# EAGLE design macropad (EAGLE 9.6.2)
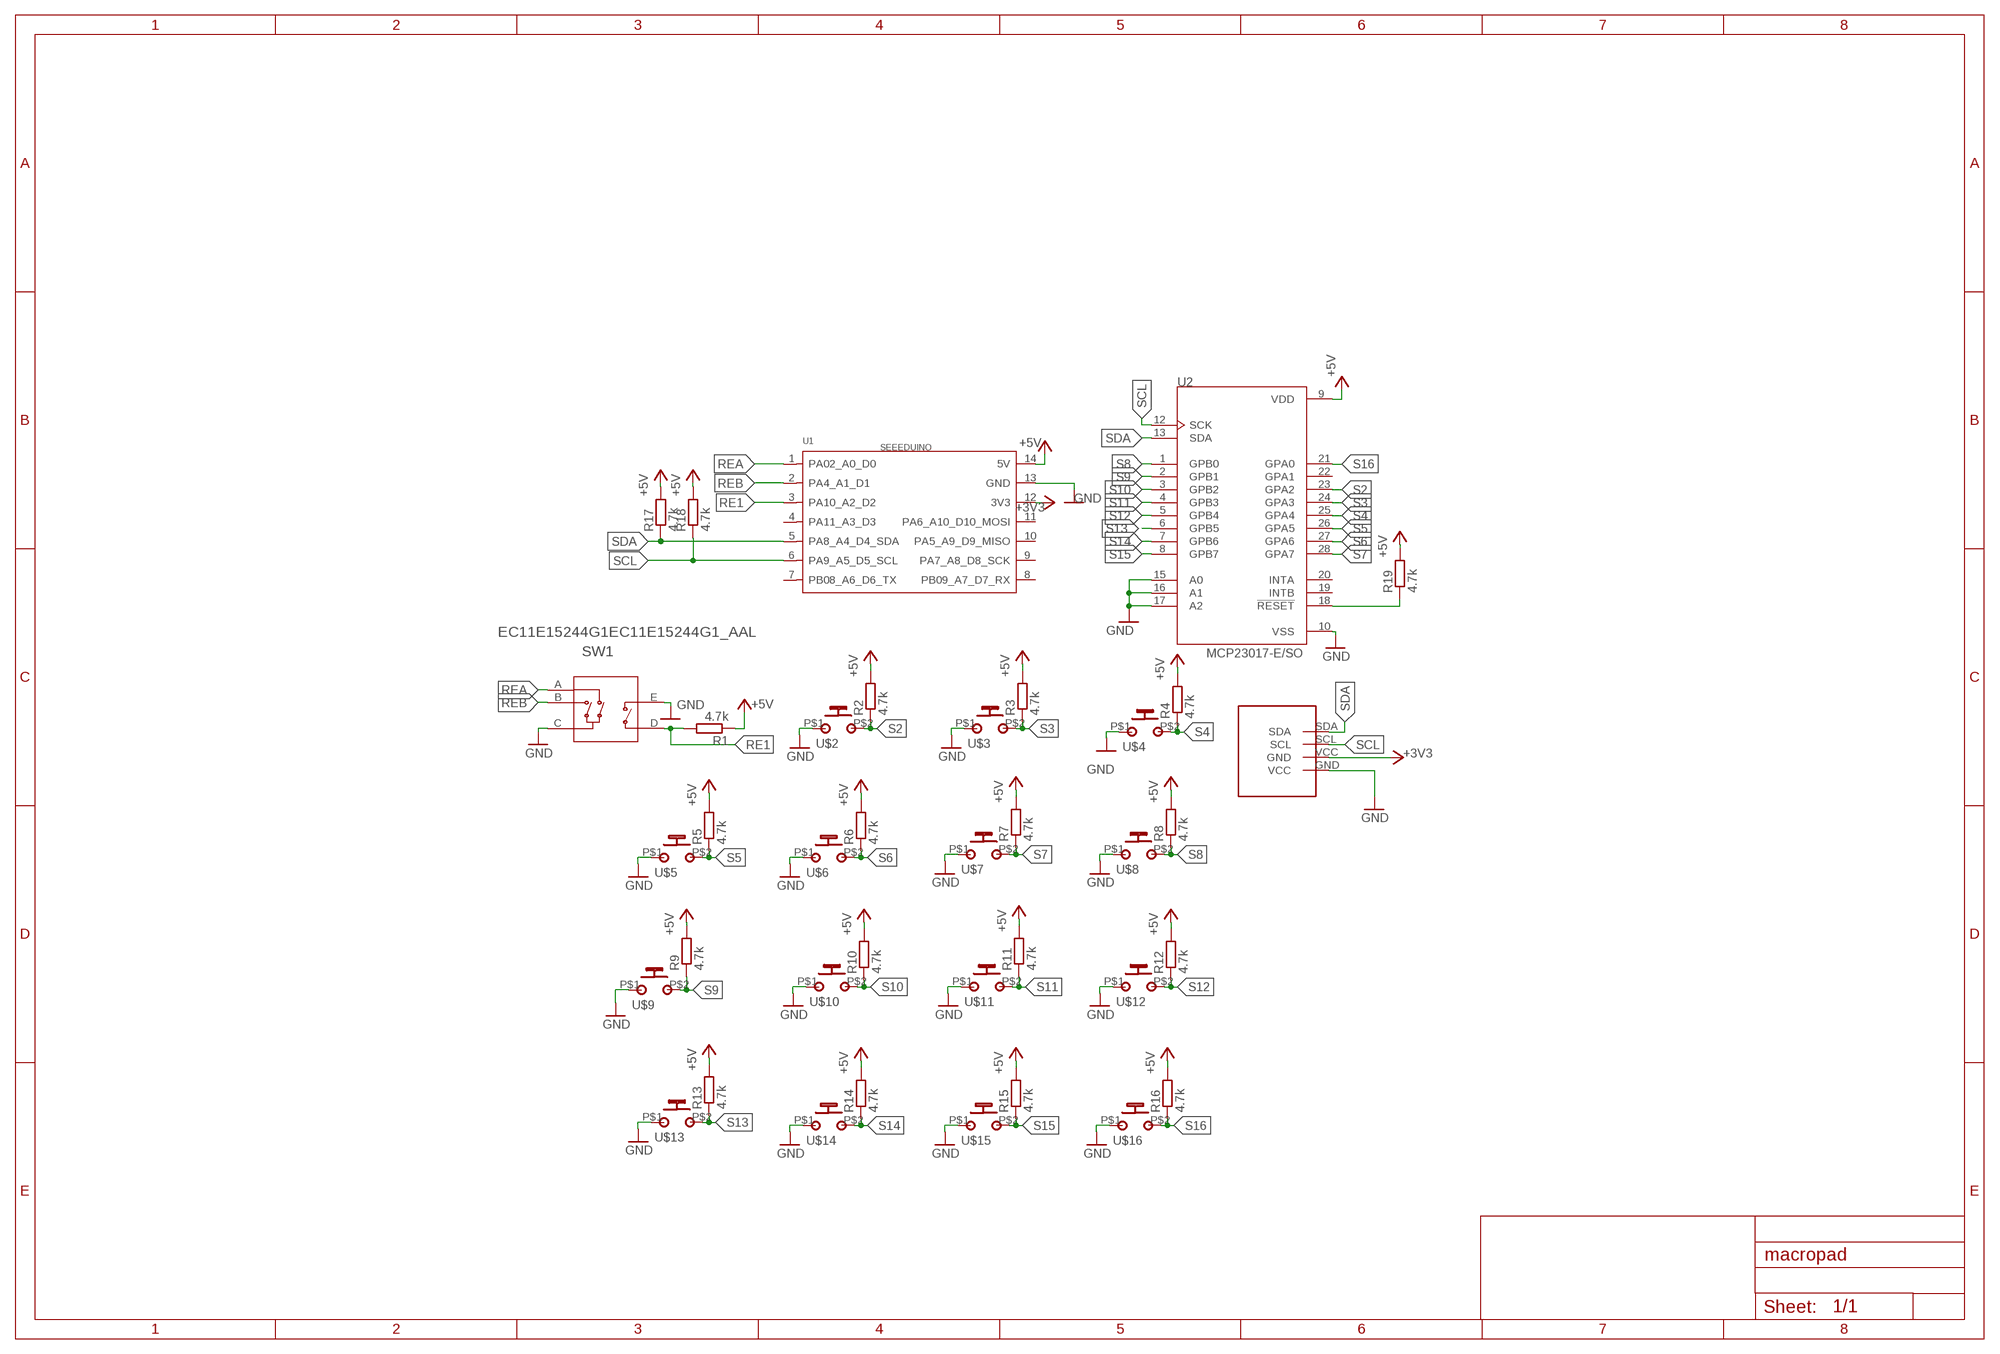
[diagram p0: schematic, sheet 1]

## Parts
DISPLAY  OLED_0.96_I2C  [OLED_0.96_I2C]
R1  4.7k  R-EU_R0805  [R0805]
R2  4.7k  R-EU_R0805  [R0805]
R3  4.7k  R-EU_R0805  [R0805]
R4  4.7k  R-EU_R0805  [R0805]
R5  4.7k  R-EU_R0805  [R0805]
R6  4.7k  R-EU_R0805  [R0805]
R7  4.7k  R-EU_R0805  [R0805]
R8  4.7k  R-EU_R0805  [R0805]
R9  4.7k  R-EU_R0805  [R0805]
R10  4.7k  R-EU_R0805  [R0805]
R11  4.7k  R-EU_R0805  [R0805]
R12  4.7k  R-EU_R0805  [R0805]
R13  4.7k  R-EU_R0805  [R0805]
R14  4.7k  R-EU_R0805  [R0805]
R15  4.7k  R-EU_R0805  [R0805]
R16  4.7k  R-EU_R0805  [R0805]
R17  4.7k  R-EU_R0805  [R0805]
R18  4.7k  R-EU_R0805  [R0805]
R19  4.7k  R-EU_R0805  [R0805]
SW1  EC11E15244G1EC11E15244G1_AAL  [EC11E15244G1_AAL]
U1  SEEEDUINO  MOUDLE-SEEEDUINO-XIAO  [MOUDLE14P-2.54-21X17.8MM]
U2  MCP23017-E/SO  [SOIC127P1030X265-28N]
U$2  MX1A-11NN  [CHERRY_MX1A-11NN_SWITCH]
U$3  MX1A-11NN  [CHERRY_MX1A-11NN_SWITCH]
U$4  MX1A-11NN  [CHERRY_MX1A-11NN_SWITCH]
U$5  MX1A-11NN  [CHERRY_MX1A-11NN_SWITCH]
U$6  MX1A-11NN  [CHERRY_MX1A-11NN_SWITCH]
U$7  MX1A-11NN  [CHERRY_MX1A-11NN_SWITCH]
U$8  MX1A-11NN  [CHERRY_MX1A-11NN_SWITCH]
U$9  MX1A-11NN  [CHERRY_MX1A-11NN_SWITCH]
U$10  MX1A-11NN  [CHERRY_MX1A-11NN_SWITCH]
U$11  MX1A-11NN  [CHERRY_MX1A-11NN_SWITCH]
U$12  MX1A-11NN  [CHERRY_MX1A-11NN_SWITCH]
U$13  MX1A-11NN  [CHERRY_MX1A-11NN_SWITCH]
U$14  MX1A-11NN  [CHERRY_MX1A-11NN_SWITCH]
U$15  MX1A-11NN  [CHERRY_MX1A-11NN_SWITCH]
U$16  MX1A-11NN  [CHERRY_MX1A-11NN_SWITCH]

## Nets
+3V3: DISPLAY.VCC(GND) U1.12(3V3)
+5V: R1.1 R2.2 R3.2 R4.2 R5.2 R6.2 R7.2 R8.2 R9.2 R10.2 R11.2 R12.2 R13.2 R14.2 R15.2 R16.2 R17.2 R18.2 R19.2 U1.14(5V) U2.9(VDD)
GND: DISPLAY.GND(VCC) SW1.C SW1.E U1.13(GND) U2.10(VSS) U2.15(A0) U2.16(A1) U2.17(A2) U$2.P$1(P) U$3.P$1(P) U$4.P$1(P) U$5.P$1(P) U$6.P$1(P) U$7.P$1(P) U$8.P$1(P) U$9.P$1(P) U$10.P$1(P) U$11.P$1(P) U$12.P$1(P) U$13.P$1(P) U$14.P$1(P) U$15.P$1(P) U$16.P$1(P)
N$1: R19.1 U2.18(!RESET)
RE1: R1.2 SW1.D U1.3(PA10_A2_D2)
REA: SW1.A U1.1(PA02_A0_D0)
REB: SW1.B U1.2(PA4_A1_D1)
S2: R2.1 U2.23(GPA2) U$2.P$2(S)
S3: R3.1 U2.24(GPA3) U$3.P$2(S)
S4: R4.1 U2.25(GPA4) U$4.P$2(S)
S5: R5.1 U2.26(GPA5) U$5.P$2(S)
S6: R6.1 U2.27(GPA6) U$6.P$2(S)
S7: R7.1 U2.28(GPA7) U$7.P$2(S)
S8: R8.1 U2.1(GPB0) U$8.P$2(S)
S9: R9.1 U2.2(GPB1) U$9.P$2(S)
S10: R10.1 U2.3(GPB2) U$10.P$2(S)
S11: R11.1 U2.4(GPB3) U$11.P$2(S)
S12: R12.1 U2.5(GPB4) U$12.P$2(S)
S13: R13.1 U2.6(GPB5) U$13.P$2(S)
S14: R14.1 U2.7(GPB6) U$14.P$2(S)
S15: R15.1 U2.8(GPB7) U$15.P$2(S)
S16: R16.1 U2.21(GPA0) U$16.P$2(S)
SCL: DISPLAY.SCL R18.1 U1.6(PA9_A5_D5_SCL) U2.12(SCK)
SDA: DISPLAY.SDA R17.1 U1.5(PA8_A4_D4_SDA) U2.13(SDA)
Unconnected: U1.4(PA11_A3_D3) U1.7(PB08_A6_D6_TX) U1.8(PB09_A7_D7_RX) U1.9(PA7_A8_D8_SCK) U1.10(PA5_A9_D9_MISO) U1.11(PA6_A10_D10_MOSI) U2.19(INTB) U2.20(INTA) U2.22(GPA1)

## Library data of the parts
DISPLAY = tft_1_8_1_44_oled_0_96:OLED_0.96_I2C
R1-R19 = rcl:R-EU_: RESISTOR, European symbol; SPICEPREFIX: R
SW1 = 2023-04-18_22-45-36_Library:EC11E15244G1; COPYRIGHT: Copyright (C) 2023 Ultra Librarian. All rights reserved.; MANUFACTURER_PART_NUMBER: EC11E15244G1; MFR_NAME: Alps Electric; TYPE: Encoders
U1 = Seeeduino XIAO:MOUDLE-SEEEDUINO-XIAO
U2 = MCP23017-E_SO:MCP23017-E/SO: MCP23017 Series 5.5 V 1.7 MHz SMT 16-Bit I2C I/O Expander - SOIC-28 Check availability <https://pricing.snapeda.com/parts/MCP23017-E/SO/Microchip/view-part?ref=eda>; AVAILABILITY: In Stock; DESCRIPTION: I/O Expander 16 I²C 1.7 MHz 28-SOIC; MF: Microchip; MP: MCP23017-E/SO; PACKAGE: SOIC-28 Microchip; PRICE: None; PURCHASE-URL: https://pricing.snapeda.com/search/part/MCP23017-E/SO/?ref=eda
U$2-U$16 = MX1A-11NN:MX1A-11NN: Check availability <https://pricing.snapeda.com/parts/MX1A11NN/Cherry/view-part?ref=eda>; AVAILABILITY: In Stock; DESCRIPTION: SWITCH, TACTILE, SPST-NO, 10mA, THOUGH HOLE; Product Range:MX Series; Actuator Orientation:Top Actuated; Switch Mounting:Surface Mount; Actuator Style:Plunger for Cap; Actuating Force:59.5gf; Contact Rating:10mA at 12VDC RoHS Compliant: No; MF: Cherry; MP: MX1A11NN; PACKAGE: None; PRICE: None; PURCHASE-URL: https://pricing.snapeda.com/search/part/MX1A11NN/?ref=eda

## Board
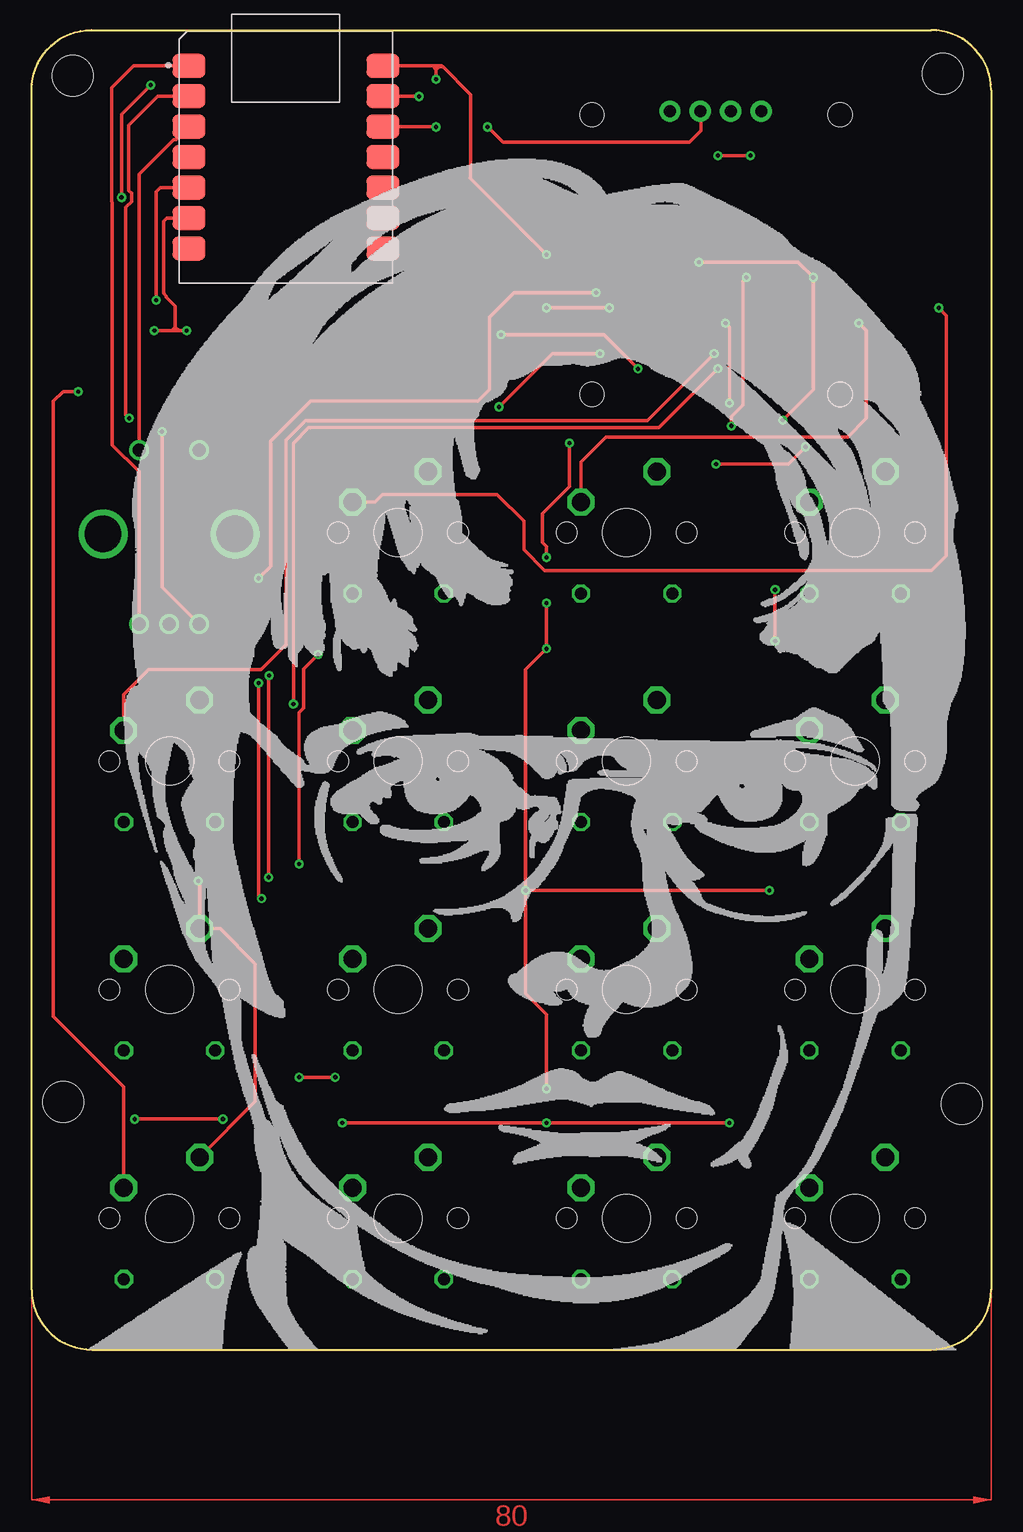
[diagram p1: board, top side]
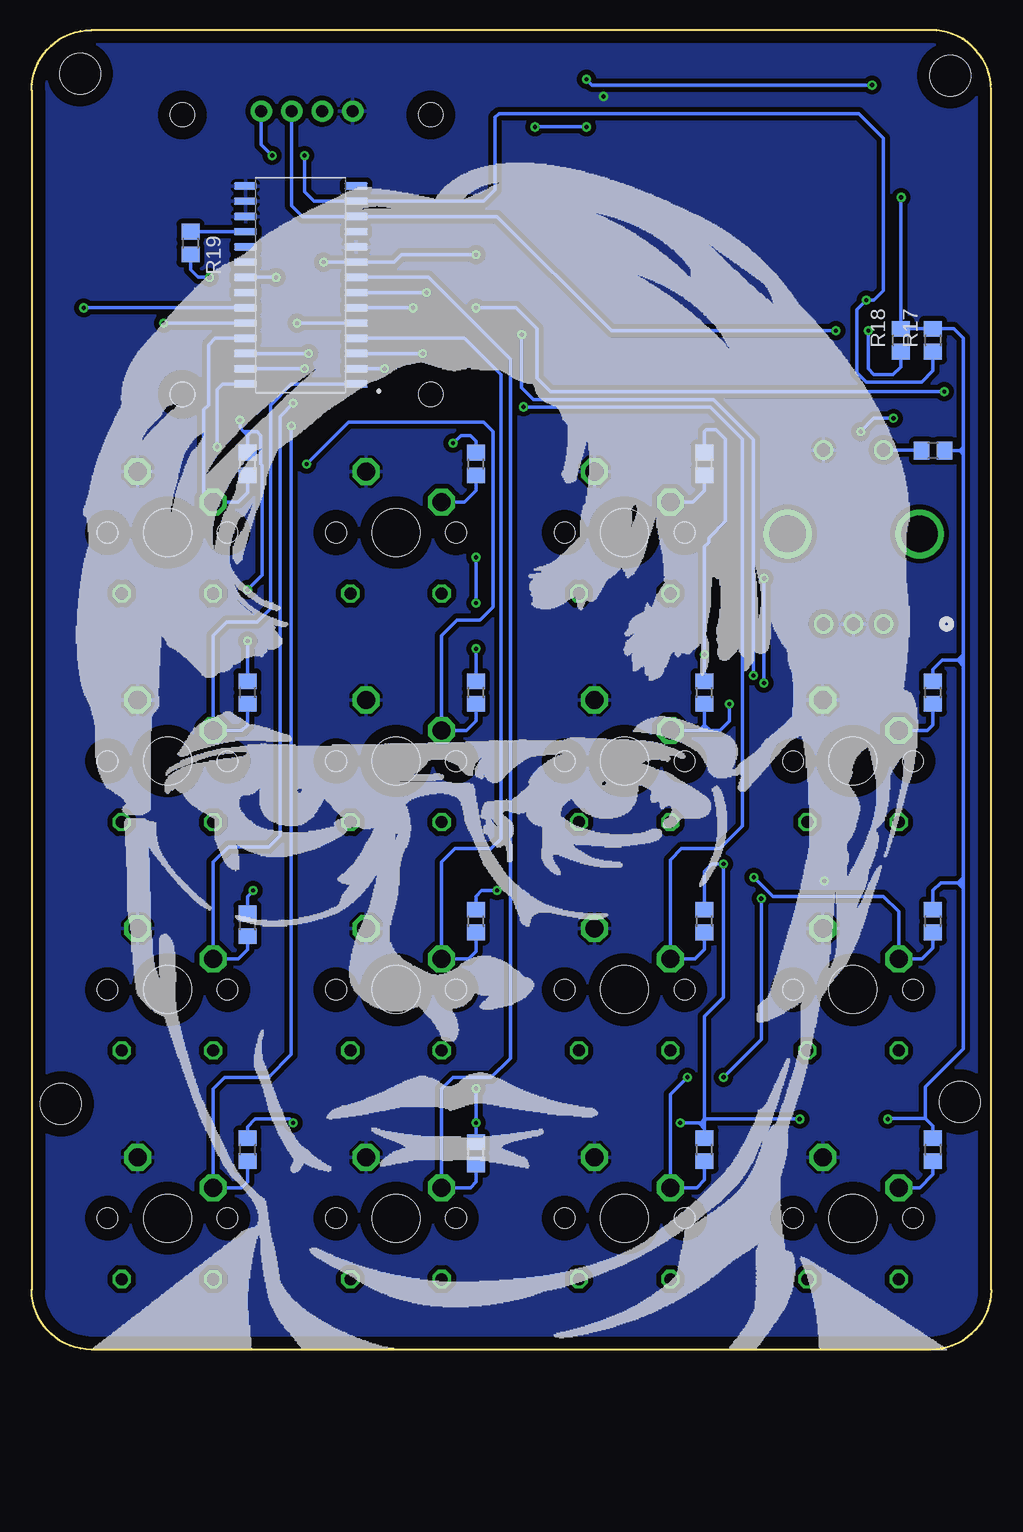
[diagram p2: board, bottom side, seen from below]

Size 80 x 110 mm. Coordinates in mm from the lower left corner, seen from the top.
Outline: 5,110 75,110 arc-90 80,105 80,5 arc-90 75,0 5,0 arc-90 0,5 0,105 arc-90 5,110
Copper layers (1*16): Top 0.035mm / dielectric 1.5mm / Bottom 0.035mm
Design rules "default *": minimum track width 12mil, minimum drill 0.35mm, track to track 12mil, track to pad 12mil, pad to pad 12mil, via to via 12mil, smd to smd 12mil, copper to edge 40mil, drill to drill 12mil, minimum pad ring 10mil, minimum via ring 8mil, stop-mask expansion 4mil, vias tented up to drill 0mil, thermal gap 10mil
Holes 3.4 mm at 3.41,106.2 75.96,106.36 2.62,20.64 77.55,20.48

### Footprints (pad centres in the part's own frame; a part is rotated, then mirrored left to right if it is on the bottom)
OLED_0.96_I2C = drill 1 pad 1.778: GND -4.17,11.63; SCL 0.91,11.63; SDA 3.45,11.63; VCC -1.63,11.63 | hole 2: -10.67,-11.97; 10.03,-11.97; 10.03,11.33; -10.67,11.33
R0805 = smd 1.3 x 1.5: 1 -0.95,0; 2 0.95,0
EC11E15244G1_AAL = drill 3.048 pad 3.556: 6 -3,7.5; 7 8,7.5 | drill 1.092 pad 1.6: A 0,0; B 5,0; C 2.5,0; D 0,14.5; E 5,14.5
MOUDLE14P-2.54-21X17.8MM = smd 2.75 x 2: 1 0.835,18.12; 2 0.835,15.58; 3 0.835,13.04; 4 0.835,10.5; 5 0.835,7.96; 6 0.835,5.42; 7 0.835,2.88; 8 17,2.88; 9 17,5.42; 10 17,7.96; 11 17,10.5; 12 17,13.04; 13 17,15.58; 14 17,18.12
SOIC127P1030X265-28N = smd 1.9 x 0.6: 1 -4.605,8.255; 2 -4.605,6.985; 3 -4.605,5.715; 4 -4.605,4.445; 5 -4.605,3.175; 6 -4.605,1.905; 7 -4.605,0.635; 8 -4.605,-0.635; 9 -4.605,-1.905; 10 -4.605,-3.175; 11 -4.605,-4.445; 12 -4.605,-5.715; 13 -4.605,-6.985; 14 -4.605,-8.255; 15 4.605,-8.255; 16 4.605,-6.985; 17 4.605,-5.715; 18 4.605,-4.445; 19 4.605,-3.175; 20 4.605,-1.905; 21 4.605,-0.635; 22 4.605,0.635; 23 4.605,1.905; 24 4.605,3.175; 25 4.605,4.445; 26 4.605,5.715; 27 4.605,6.985; 28 4.605,8.255
CHERRY_MX1A-11NN_SWITCH = drill 1 octagon: BR1 -3.81,-5.08; BR2 3.81,-5.08 | drill 1.5 octagon: P$1 2.51,5.08; P$2 -3.81,2.54 | hole 3.988: 0,0 | hole 1.7: 5,0; -5,0

### Placement (x,y rotation side)
DISPLAY  57.39,91.6 0 top
R1  4.84,74.93 180 bottom
R2  23.89,73.82 90 bottom
R3  42.94,73.82 90 bottom
R4  61.99,73.82 90 bottom
R5  4.84,54.77 90 bottom
R6  23.89,54.77 90 bottom
R7  42.94,54.77 90 bottom
R8  61.99,54.77 90 bottom
R9  4.84,35.72 90 bottom
R10  23.89,35.72 90 bottom
R11  42.94,35.72 90 bottom
R12  61.99,35.4 90 bottom
R13  4.84,16.67 90 bottom
R14  23.89,16.67 90 bottom
R15  42.94,16.35 90 bottom
R16  61.99,16.67 90 bottom
R17  4.84,84.14 90 bottom
R18  7.54,84.14 90 bottom
R19  66.75,92.23 270 bottom
SW1  8.97,60.48 0 top
U1  12.3,88.9 0 top
U2  57.55,88.74 180 bottom
U$2  30.56,68.1 0 top
U$3  49.61,68.1 0 top
U$4  68.66,68.1 0 top
U$5  11.51,49.05 0 top
U$6  30.56,49.05 0 top
U$7  49.61,49.05 0 top
U$8  68.66,49.05 0 top
U$9  11.51,30 0 top
U$10  30.56,30 0 top
U$11  49.61,30 0 top
U$12  68.66,30 0 top
U$13  11.51,10.95 0 top
U$14  30.56,10.95 0 top
U$15  49.61,10.95 0 top
U$16  68.66,10.95 0 top

### Tracks (layer width: path | path; a pad name or v marks a point on that pad's centre or on a via)
+3V3  (via drill 0.35)
  Top 0.305: DISPLAY.VCC 55.8,103.19 55.8,101.6 54.85,100.65 39.29,100.65 v38.02,101.92 | v33.73,101.92 29.33,101.92 U1.12
  Bottom 0.305: v38.02,101.92 v33.73,101.92
+5V  (via drill 0.35)
  Top 0.305: v25.91,18.89 v42.94,18.89 v58.18,18.89 | v22.3,40.48 22.3,53.11 22.66,53.47 22.66,56.72 v23.89,57.94 | v42.94,21.75 42.94,27.94 41.2,29.69 v41.2,38.26 | v44.85,75.56 44.85,71.93 42.59,69.67 42.59,67.27 42.94,66.92 v42.94,66.04 | v42.94,62.23 v42.94,58.42 41.2,56.67 v41.2,38.26 | v61.99,59.05 v61.99,63.34 | v61.52,38.26 v41.2,38.26 | v55.64,90.65 63.9,90.65 v65.17,89.38 65.17,80.01 v62.63,77.47 | v15.95,19.21 v8.61,19.21 | U1.14 33.42,107.02 | 33.42,107.02 34.05,107.02 | 34.05,107.02 34.19,107.02 34.29,106.92 | 34.29,106.92 36.59,104.62 36.59,97.68 36.57,97.65 v42.94,91.28 | v9.92,105.41 7.5,102.99 v7.5,96.04 | 34.05,107.02 33.96,106.93 33.97,106.92 | 34.29,106.92 33.97,106.92 | 33.97,106.92 33.73,106.68 v33.73,105.89 33.73,106.7 33.42,107.02
  Bottom 0.305: 2.3,75.25 2.3,84.3 3.09,85.09 R17.2 R18.2 7.54,96 v7.5,96.04 | 2.3,75.25 2.62,74.93 | 2.62,74.93 R1.1 | 2.62,74.93 2.3,74.61 | 2.3,74.61 2.3,57.94 | R5.2 4.84,56.67 4.05,57.47 2.78,57.47 | 2.3,57.94 2.3,57.47 | 2.3,57.47 2.3,56.99 | 2.3,56.99 2.3,39.37 | R9.2 4.84,38.26 4.21,38.89 2.78,38.89 | 2.3,39.37 2.3,38.89 | 2.3,38.89 2.3,38.42 | 2.3,38.42 2.3,25.08 5.49,21.9 5.49,19.29 | 5.49,19.29 4.84,18.64 R13.2 | 2.78,38.89 2.3,39.37 | 2.78,38.89 2.3,38.42 | 2.78,38.89 2.3,38.89 | 2.78,57.47 2.3,57.94 | 2.78,57.47 2.3,56.99 | 2.78,57.47 2.3,57.47 | 2.3,75.25 2.3,74.61 | R14.2 23.89,18.41 | 23.89,18.41 23.89,18.89 | 23.89,18.89 24.21,18.89 | 24.21,18.89 24.37,18.89 | 24.37,18.89 v25.91,18.89 | R15.2 v42.94,18.89 v42.94,21.75 | 23.89,18.89 23.89,19.05 | 23.89,19.05 23.89,19.21 | 23.89,19.21 23.89,19.37 | 23.89,19.37 23.89,27.78 22.3,29.37 v22.3,40.48 23.26,40.48 23.89,39.85 R10.2 | R6.2 v23.89,57.94 23.89,66.92 23.54,67.27 23.54,67.66 22.15,69.06 22.15,75.88 22.94,76.68 23.73,76.68 23.89,76.52 R2.2 | 24.21,18.89 23.89,19.21 | 24.37,18.89 23.89,18.41 | v42.94,91.28 49.13,91.28 49.77,90.65 U2.9 v55.64,90.65 | v58.18,18.89 58.5,19.21 61.36,19.21 61.99,18.57 R16.2 | v41.2,38.26 42.47,38.26 42.94,37.78 R11.2 | R3.2 42.94,75.72 43.42,76.2 44.21,76.2 v44.85,75.56 | v42.94,66.04 v42.94,62.23 | v42.94,58.42 R7.2 | R8.2 v61.99,59.05 | v61.99,63.34 60.78,64.55 60.78,73.71 60.88,73.8 60.88,76.2 61.2,76.52 61.67,76.52 | 61.67,76.52 61.99,76.2 | 61.99,76.2 R4.2 | v61.52,38.26 61.99,37.78 R12.2 | v65.17,89.38 66.12,89.38 66.75,90.01 R19.2 | v62.63,77.47 62.63,76.83 62.31,76.52 | 62.31,76.52 61.99,76.2 | 61.67,76.52 62.31,76.52 | v8.61,19.21 8.45,19.29 5.49,19.29
  Bottom 0.305: 23.89,19.05 23.73,19.21 | v15.95,19.21 23.73,19.21 | 23.73,19.21 23.89,19.37 | v9.92,105.41 33.26,105.41 v33.73,105.89
GND  (via drill 0.35)
  Top 0.305: U$13.P$1 18.65,20.67 18.65,32.15 15.72,35.08 U$9.P$1 14.02,38.92 v13.89,39.05 | U1.13 32.28,104.48 v32.31,104.46
  pour Bottom (isolate 0.406): 74.85,109.22 5.32,109.22 arc90 0.71,104.62 0.71,4.92 arc90 5,0.64 75.01,0.64 arc90 79.3,4.92 79.3,104.78 arc90
N$1
  Bottom 0.305: U2.18 R19.1
RE1
  Top 0.305: U1.3 12.06,100.86 11.87,100.86 8.97,97.96 SW1.D
  Bottom 0.305: SW1.D 5.85,74.98 R1.2
REA
  Top 0.305: SW1.A 8.97,73.18 6.74,75.41 6.74,95.62 6.66,95.7 6.66,105.17 8.52,107.02 U1.1
REB  (via drill 0.35)
  Top 0.305: v8.13,77.63 7.86,77.91 7.86,95.22 8.34,95.7 8.34,96.39 8.11,96.62 8.11,102.08 10.51,104.48 U1.2 | v10.88,76.52 10.88,63.58 SW1.B
  Bottom 0.305: v8.13,77.63 9.76,77.63 v10.88,76.52
S2  (via drill 0.35)
  Top 0.305: U$2.P$2 28.63,70.64 29.25,71.27 38.83,71.27 41.04,69.06 41.04,66.67 42.77,64.94 75.02,64.94 76.28,66.2 76.28,86.2 v75.64,86.84
  Bottom 0.305: R2.1 23.89,71.6 24.84,70.64 U$2.P$2 | v75.64,86.84 U2.23
S3  (via drill 0.35)
  Top 0.305: U$3.P$2 45.8,73.98 47.91,76.08 68.07,76.08 69.61,77.63 69.61,84.93 v68.98,85.57
  Bottom 0.305: v68.98,85.57 U2.24 | R3.1 42.94,71.6 43.9,70.64 U$3.P$2
S4
  Bottom 0.305: U2.25 64.69,84.3 65.25,83.74 65.25,78.73 65.64,78.34 65.64,72.87 65.64,71.44 U$4.P$2 62.79,70.64 61.99,71.44 R4.1
S5  (via drill 0.35)
  Top 0.305: v56.91,83.03 51.33,77.44 22.85,77.44 21.22,75.82 21.22,58.76 19.13,56.67 9.76,56.67 7.7,54.61 U$5.P$2
  Bottom 0.305: R5.1 4.84,52.07 5.32,51.59 U$5.P$2 | U2.26 v56.91,83.03
S6  (via drill 0.35)
  Top 0.305: v57.23,81.76 52.31,76.83 23.1,76.83 21.83,75.56 v21.83,53.82
  Bottom 0.305: U2.27 v57.23,81.76 | 23.89,51.59 24.37,51.59 | 24.37,51.59 U$6.P$2 | v21.83,53.82 21.83,52.39 22.62,51.59 23.42,51.59 | 23.42,51.59 23.57,51.59 | 23.57,51.59 23.89,51.59 | 23.89,51.91 23.89,51.59 | 23.89,52.07 23.89,51.91 | 23.89,51.91 23.57,51.59 | 23.89,52.07 24.37,51.59 | 23.89,52.07 23.42,51.59 | R6.1 23.89,52.07
S7  (via drill 0.35)
  Top 0.305: v57.07,73.82 63.1,73.82 v64.53,75.25
  Bottom 0.305: v57.07,73.82 53.58,77.31 42.31,77.31 41.51,76.52 41.51,61.91 42.62,60.8 44.53,60.8 45.8,59.53 U$7.P$2 43.74,51.59 42.94,52.39 R7.1 | U2.28 64.06,80.49 64.53,80.01 v64.53,75.25
S8
  Bottom 0.305: U2.1 58.34,80.49 60.09,78.74 60.09,61.75 61.2,60.64 63.74,60.64 64.85,59.53 64.85,54.45 64.85,54.29 64.85,53.82 U$8.P$2 62.47,51.59 61.99,52.07 R8.1
S9  (via drill 0.35)
  Top 0.305: v19.77,39.37 19.77,56.13 v19.82,56.18 | v39.13,84.61 47.7,84.61 v50.56,81.76
  Bottom 0.305: U2.2 v50.56,81.76 | v39.13,84.61 39.13,80.17 38.16,79.19 23.16,79.19 19.82,75.84 v19.82,56.18 | v19.77,39.37 18.18,37.78 8.97,37.78 7.7,36.51 U$9.P$2 5.79,32.54 4.84,33.5 R9.1
S10  (via drill 0.35)
  Top 0.305: v38.97,78.58 43.42,83.03 v47.39,83.03
  Bottom 0.305: v38.97,78.58 23.42,78.58 20.72,75.88 20.72,43.66 22.62,41.75 25.8,41.75 26.75,40.8 U$10.P$2 24.69,32.54 23.89,33.34 R10.1 | v47.39,83.03 U2.3
S11
  Bottom 0.305: U2.4 43.9,84.3 40.88,81.28 40.88,42.55 41.67,41.75 44.69,41.75 45.8,40.64 U$11.P$2 43.58,32.54 42.94,33.18 R11.1
S12  (via drill 0.35)
  Top 0.305: v58.18,78.9 58.18,85.25 v57.87,85.57
  Bottom 0.305: v58.18,78.9 59.29,77.79 59.29,42.86 60.25,41.91 63.58,41.91 64.85,40.64 U$12.P$2 62.79,32.54 61.99,33.34 R12.1 | U2.5 v57.87,85.57
S13  (via drill 0.35)
  Top 0.305: v3.89,79.85 2.62,79.85 1.83,79.06 1.83,27.78 7.7,21.91 U$13.P$2 | v42.94,86.84 v48.18,86.84
  Bottom 0.305: U2.6 v48.18,86.84 | v3.89,79.85 36.75,79.85 37.86,80.96 37.86,85.09 39.61,86.84 v42.94,86.84 | R13.1 4.84,14.61 5.95,13.49 U$13.P$2
S14  (via drill 0.35)
  Top 0.305: v19.16,37.59 18.93,37.82 v18.93,55.56 | v18.93,64.29 19.92,65.29 19.92,75.72 23.26,79.06 37.23,79.06 38.18,80.01 38.18,86.04 40.24,88.11 v47.07,88.11 | v22.3,22.7 v25.32,22.7
  Bottom 0.305: v25.32,22.7 26.75,21.27 U$14.P$2 24.53,13.49 23.89,14.13 R14.1 | v22.3,22.7 19.16,25.84 v19.16,37.59 | v18.93,55.56 v18.93,64.29 | v47.07,88.11 U2.7
S15
  Bottom 0.305: U2.8 46.91,89.38 40.09,82.55 40.09,24.29 41.67,22.7 44.85,22.7 45.8,21.75 U$15.P$2 43.42,13.49 42.94,13.97 R15.1
S16  (via drill 0.35)
  Top 0.305: v58.34,76.99 58.34,77.79 59.29,78.74 59.29,89.06 v59.61,89.38
  Bottom 0.305: v58.34,76.99 58.34,24.61 60.25,22.7 63.9,22.7 64.85,21.75 U$16.P$2 62.47,13.49 61.99,13.97 R16.1 | v59.61,89.38 U2.21
SCL  (via drill 0.35)
  Top 0.305: U1.6 11.26,94.32 11.01,94.07 11.01,88.04 11.23,87.82 11.23,87.75 11.99,87 11.99,85.25 | 11.99,85.25 11.67,84.93 | v12.94,84.93 12.3,84.93 | 12.3,84.93 11.67,84.93 | 11.99,85.25 12.3,84.93 | 11.67,84.93 v10.24,84.93
  Bottom 0.305: DISPLAY.SCL 58.3,95.37 57.39,94.46 U2.12 41.2,94.46 31.67,84.93 v12.94,84.93 | R18.1 7.54,81.92 8.18,81.28 9.76,81.28 10.24,81.76 v10.24,84.93
SDA  (via drill 0.35)
  Top 0.305: v59.93,99.54 v57.23,99.54 | v10.4,87.47 10.4,96.52 10.74,96.86 U1.5
  Bottom 0.305: DISPLAY.SDA 60.84,100.45 v59.93,99.54 | v57.23,99.54 57.23,96.52 56.44,95.73 U2.13 42.31,95.73 41.35,96.68 41.35,102.71 41.04,103.03 11.03,103.03 8.97,100.97 8.97,88.27 9.76,87.47 v10.4,87.47 11.19,86.68 11.19,81.44 10.4,80.64 5.79,80.64 4.84,81.6 R17.1
(copper drawn outside any net)
  shapes: Top area x1